# Altium schematic sheet Interfaces.SchDoc
size A4; DocumentNumber: 3; SheetNumber: 3; SheetTotal: 3
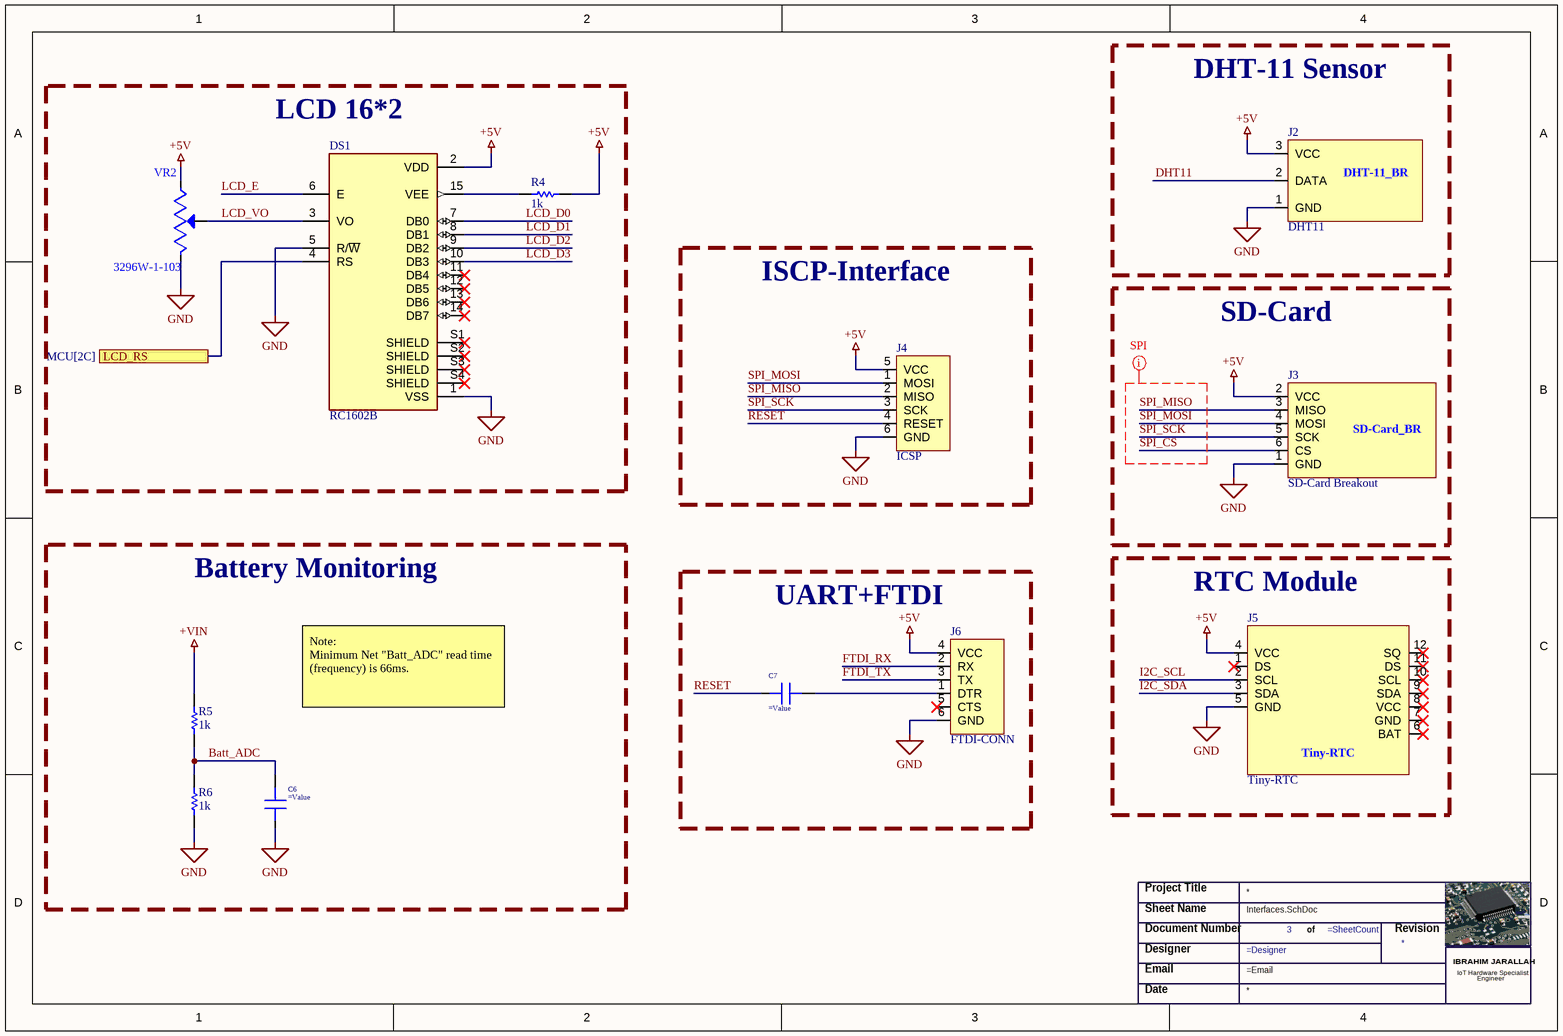
[diagram p0: Interfaces.SchDoc]

## Parts
*  Title_block_Medium  (value not drawn)
C6  (no value)  [C 0805(2012)x0.85]
C7  (no value)  [C 0805(2012)x0.85]
DS1  RC1602B  [LCD_RC1602B-BIW-CSV]
J2  DHT11  [DHT11-BREAKOUT]
J3  SD-Card Breakout  [SD-Card Breakout]
J4  ICSP  [FTDI]
J5  Tiny-RTC  [Tiny-RTC]
J6  FTDI-CONN  [FTDI]
R4  1k  [RESC2013X50X30LL20T20]
R5  1k  [FP-CRCW1206-e3-IPC_B]
R6  1k  [FP-CRCW1206-e3-IPC_B]
VR2  3296W-1-103  [TRIM_3296W-1-103]

## Blocks framed on the sheet
LCD 16*2: DS1 R4 VR2
DHT-11 Sensor: J2
ISCP-Interface: J4
SD-Card: J3
Battery Monitoring: C6 R5 R6
RTC Module: J5
UART+FTDI: C7 J6

## Ports
LCD_RS (see MCU[2C])

## Nets
+5V: DS1.2(VDD) J2.3(VCC) J3.2(VCC) J4.5(VCC) J5.4(VCC) J6.4(VCC) R4.1 VR2.3(CW)
+VIN: R5.2
GND: C6.1 DS1.1(VSS) DS1.5(R/~{W}) J2.1(GND) J3.1(GND) J4.6(GND) J5.5(GND) J6.6(GND) R6.1 VR2.1(CCW)
Batt_ADC: C6.2 R5.1 R6.2
DHT11: J2.2(DATA)
FTDI_RX: J6.2(RX)
FTDI_TX: J6.3(TX)
I2C_SCL: J5.2(SCL)
I2C_SDA: J5.3(SDA)
LCD_D0: DS1.7(DB0)
LCD_D1: DS1.8(DB1)
LCD_D2: DS1.9(DB2)
LCD_D3: DS1.10(DB3)
LCD_E: DS1.6(E)
LCD_RS: DS1.4(RS) ; port LCD_RS
LCD_VO: DS1.3(VO) VR2.2(WIPER)
RESET: C7.1 J4.4(RESET)
SPI_CS: J3.6(CS)
SPI_MISO: J3.3(MISO) J4.2(MISO)
SPI_MOSI: J3.4(MOSI) J4.1(MOSI)
SPI_SCK: J3.5(SCK) J4.3(SCK)
NetC7_2: C7.2 J6.1(DTR)
NetDS1_15: DS1.15(VEE) R4.2

Not connected (* = marked no-connect by the designer): DS1 11(DB4)* 12(DB5)* 13(DB6)* 14(DB7)* S1(SHIELD)* S2(SHIELD)* S3(SHIELD)* S4(SHIELD)*; J5 1(DS)* 6(BAT)* 7(GND)* 8(VCC)* 9(SDA)* 10(SCL)* 11(DS)* 12(SQ)*; J6 5(CTS)*

## Layout directives
net class SPI: SPI_CS, SPI_MISO, SPI_MOSI, SPI_SCK

## Notes on the sheet
- Note:
  Minimum Net "Batt_ADC" read time (frequency) is 66ms.
- Title:
- Formation Altium Designer Pro
- Sheet Name:
- Designer:
- Start Date:
- Page:
- Contact:
- of
- ct.formationelectronic@gmail.com
- Revision:
- End Date:
- Altium Designer Pro
- Formation
- (in symbol DHT11) DHT-11_BR
- (in symbol SD-Card Breakout) SD-Card_BR
- (in symbol Title_block_Medium) Project Title; Sheet Name; Document Number; of; Revision; Designer; IBRAHIM JARALLAH; Email; IoT Hardware Specialist; Engineer; Date

## Library data of the parts
C6 C7 = C 0805    50V X7R - 0*: SMD 0805     50V X7R 10%; Manufacturer: Samsung; TYPE: Capacitors; Package-mm: 2012; Part Number: *; Mount Type: SMT; Publisher: Hefest; Manufacturer Alternate: *; Part Number Alternate: *; Published: 07.04.2019; Supplier 1: Comet; Supplier 2: *; Supplier 3: *; Supplier Part Number 1: *; Supplier Part Number 2: *; Supplier Part Number 3: *; RoHS: Y; Technology: Ceramic  MLCC; Value 1: *; Value 2: *; Package: 0805; VDC: 50V; TempCo: X7R; Tolerance %: ±10%; VAC: *; ESR Ohm: *; ComponentLink1Description: Datasheet link; ComponentLink1URL: https://store.comet.bg/download-file.php?id=11; Temperature Range: -55°C ~ +125°C; Price: *
DS1 = RC1602B-BIW-CSV: Display: LCD; alphanumeric; STN Negative; 16x2; blue; LED; PIN: 16; MF: {'manufacturer': u'Raystar'}; Package: None; Price: None; Value: *; MP: RC1602B-BIW-CSV; Availability: Unavailable
J4 = ICSP: ICSP-CONN
J5 = Tiny-RTC Breakout Board
J6 = FTDI
R4 = RES-0805-SMD: Value: 1k
R5 R6 = RES-1206-SMD: Value: 1k
VR2 = 3296W-1-103: MF: {'manufacturer': u'Bourns'}; Package: None; Price: None; Value: *; MP: 3296W-1-103; Availability: Unavailable